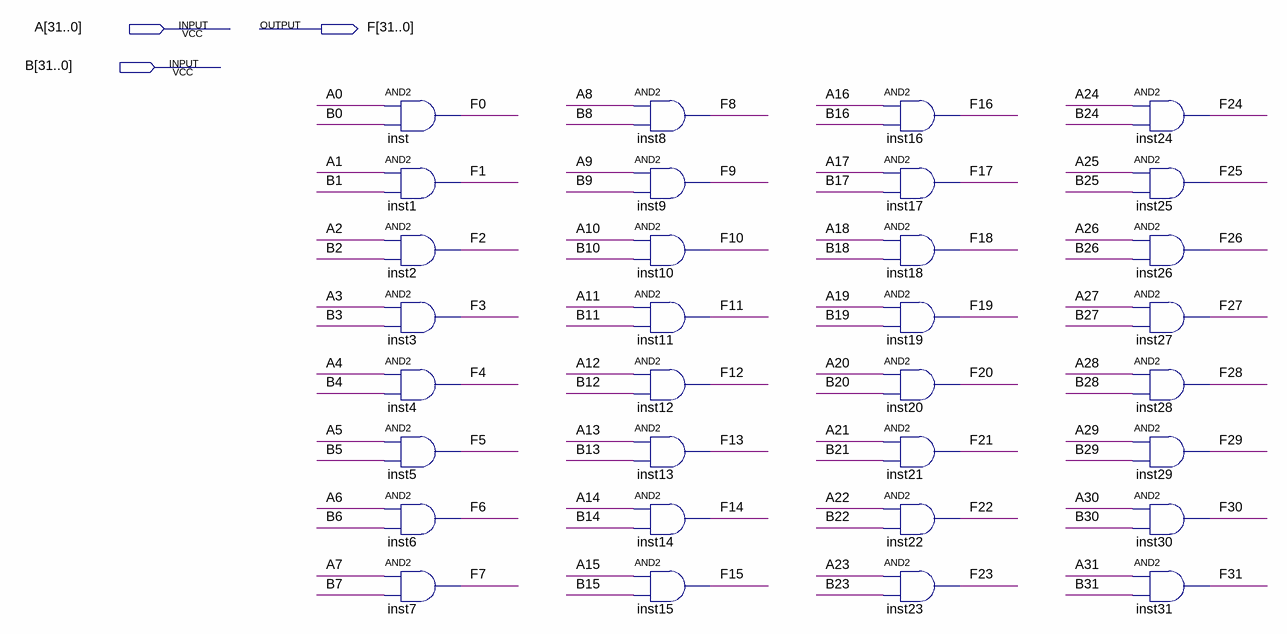
[diagram p0: schematic sheet]
// Quartus schematic AND32.bdf as structural Verilog: 32 symbols, 3 pins
module AND32 (
  input  [31:0] A,
  input  [31:0] B,
  output [31:0] F
);

  and inst (F[0], A[0], B[0]);
  and inst1 (F[1], A[1], B[1]);
  and inst2 (F[2], A[2], B[2]);
  and inst3 (F[3], A[3], B[3]);
  and inst4 (F[4], A[4], B[4]);
  and inst5 (F[5], A[5], B[5]);
  and inst6 (F[6], A[6], B[6]);
  and inst7 (F[7], A[7], B[7]);
  and inst8 (F[8], A[8], B[8]);
  and inst9 (F[9], A[9], B[9]);
  and inst10 (F[10], A[10], B[10]);
  and inst11 (F[11], A[11], B[11]);
  and inst12 (F[12], A[12], B[12]);
  and inst13 (F[13], A[13], B[13]);
  and inst14 (F[14], A[14], B[14]);
  and inst15 (F[15], A[15], B[15]);
  and inst16 (F[16], A[16], B[16]);
  and inst17 (F[17], A[17], B[17]);
  and inst18 (F[18], A[18], B[18]);
  and inst19 (F[19], A[19], B[19]);
  and inst20 (F[20], A[20], B[20]);
  and inst21 (F[21], A[21], B[21]);
  and inst22 (F[22], A[22], B[22]);
  and inst23 (F[23], A[23], B[23]);
  and inst24 (F[24], A[24], B[24]);
  and inst25 (F[25], A[25], B[25]);
  and inst26 (F[26], A[26], B[26]);
  and inst27 (F[27], A[27], B[27]);
  and inst28 (F[28], A[28], B[28]);
  and inst29 (F[29], A[29], B[29]);
  and inst30 (F[30], A[30], B[30]);
  and inst31 (F[31], A[31], B[31]);
endmodule
